# EAGLE design v5-Power-Section-temp (EAGLE 7.5.0)
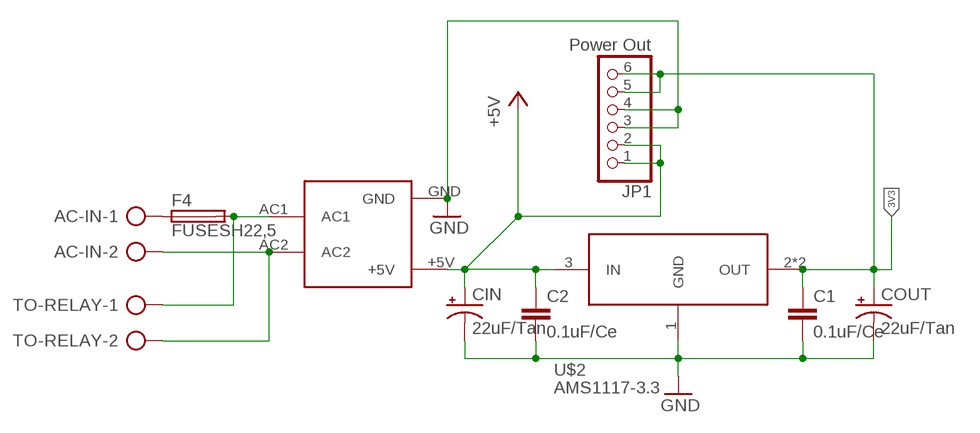
[diagram p0: schematic, sheet 1]

## Parts
AC-IN  AK300/2  [AK300/2]
C1  0.1uF/Ce  C-EU025-024X044  [C025-024X044]
C2  0.1uF/Ce  C-EU025-024X044  [C025-024X044]
CIN  22uF/Tan  CPOL-USE2.5-5  [E2,5-5]
COUT  22uF/Tan  CPOL-USE2.5-5  [E2,5-5]
F4  FUSESH22,5  [SH22,5]
JP1  Power Out  PINHD-1X6  [1X06]
TO-RELAY  AK300/2  [AK300/2]
U$1  HLK-PM01  [HLK-PM01]
U$2  AMS1117-3.3  [SOT-223]

## Nets
3V3: C1.1 COUT.+ JP1.5 JP1.6 U$2.2(OUT) U$2.4(OUT)
+5V: C2.1 CIN.+ JP1.1 JP1.2 U$1.+5V U$2.3(IN)
GND: C1.2 C2.2 CIN.- COUT.- JP1.3 JP1.4 U$1.GND U$2.1(GND)
N$1: AC-IN.1 F4.1
N$2: AC-IN.2 TO-RELAY.2 U$1.AC2
RELAY-NO: F4.2 TO-RELAY.1 U$1.AC1

## Library data of the parts
AC-IN TO-RELAY = con-ptr500:AK300/2: CONNECTOR; OC_FARNELL: unknown; OC_NEWARK: unknown
C1 C2 = rcl:C-EU: CAPACITOR, European symbol
CIN COUT = rcl:CPOL-US: POLARIZED CAPACITOR, American symbol
F4 = fuse:FUSE: Fuse; OC_FARNELL: unknown; OC_NEWARK: unknown
JP1 = pinhead:PINHD-1X6: PIN HEADER
U$1 = HLK-PM01:HLK-PM01
U$2 = AMS1117-3.3:AMS1117-3.3: 1A LOW DROPOUT VOLTAGE REGULATOR

## Board
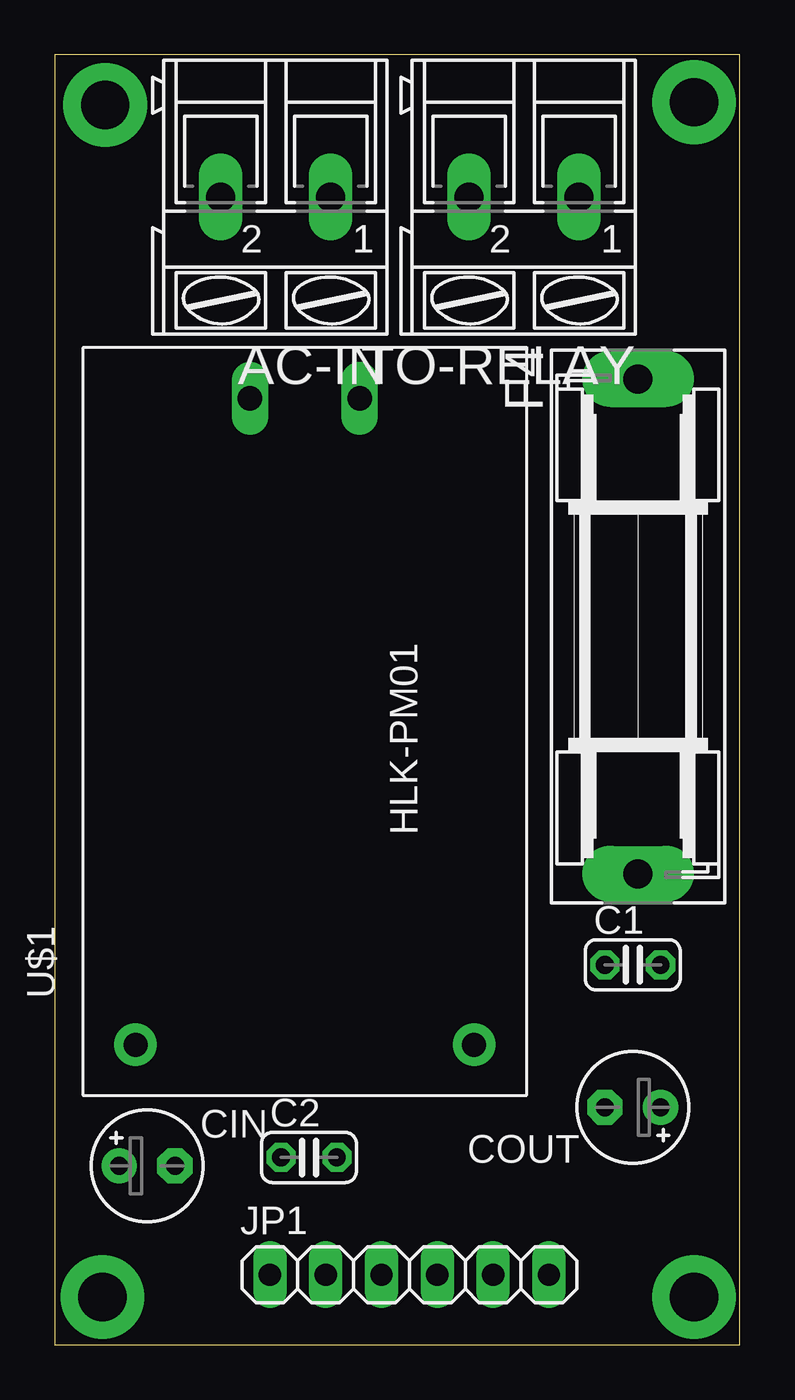
[diagram p1: board, top side]
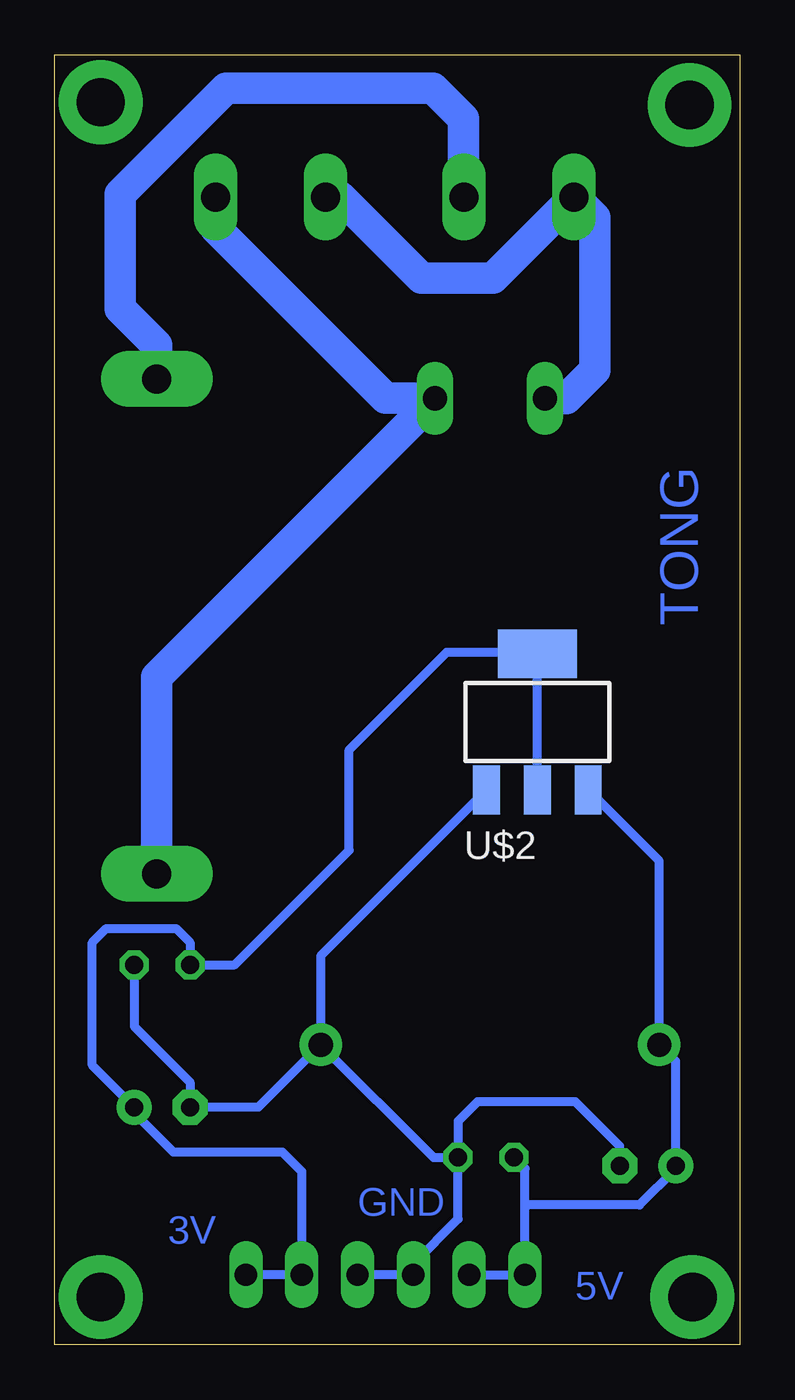
[diagram p2: board, bottom side, seen from below]

Size 31.17 x 58.66 mm. Coordinates in mm from the lower left corner, seen from the top.
Outline: 0,0 31.17,0 31.17,58.66 0,58.66 0,0
Copper layers (1*16): Top 0.035mm / dielectric 1.5mm / Bottom 0.035mm
Design rules "default": minimum track width 10mil, minimum drill 24mil, track to track 8mil, track to pad 8mil, pad to pad 8mil, via to via 8mil, smd to smd 8mil, copper to edge 40mil, drill to drill 8mil, minimum pad ring 10mil, minimum via ring 8mil, stop-mask expansion 4mil, vias tented up to drill 0mil, thermal gap 10mil

### Footprints (pad centres in the part's own frame; a part is rotated, then mirrored left to right if it is on the bottom)
AK300/2 = drill 1.321 long: 1 -2.515,0; 2 2.489,0
C025-024X044 = drill 0.813 octagon: 1 -1.27,0; 2 1.27,0
E2,5-5 = drill 0.813 pad 1.6: + -1.27,0 | drill 0.813 pad 1.6 octagon: - 1.27,0
SH22,5 = drill 1.321 pad 2.54 long: 1 -11.252,0; 2 11.252,0
1X06 = drill 1.016 long: 1 -6.35,0; 2 -3.81,0; 3 -1.27,0; 4 1.27,0; 5 3.81,0; 6 6.35,0
HLK-PM01 = drill 1.1 pad 1.93: +5V 15.19,-7.76; GND 15.19,7.64 | drill 1.1 long: AC1 -14.21,2.44; AC2 -14.21,-2.56
SOT-223 = smd 1.219 x 2.235: 1 -2.381,-3.099; 2 -0.07,-3.099; 3 2.241,-3.099 | smd 3.6 x 2.2: 4 -0.07,3.099

### Placement (x,y rotation side)
AC-IN  10.03,52.2 180 top
C1  26.29,17.27 0 top
C2  11.56,8.51 0 top
CIN  4.19,8.13 0 top
COUT  26.29,10.79 180 top
F4  26.53,32.67 270 top
JP1  16.13,3.17 0 top
TO-RELAY  21.34,52.2 180 top
U$1  11.43,28.83 270 top
U$2  9.14,28.32 0 bottom

### Tracks (layer width: path | path; a pad name or v marks a point on that pad's centre or on a via)
3V3
  Bottom 0.406: JP1.6 JP1.5 19.94,7.87 20.83,8.76 25.78,8.76 27.56,10.54 COUT.+ 29.46,12.7 29.46,18.29 28.83,18.92 25.65,18.92 25.02,18.29 C1.1 22.99,17.27 17.78,22.48 17.78,27.05 13.34,31.5 9.29,31.5 U$2.4 U$2.2
+5V
  Bottom 0.406: JP1.2 JP1.1 9.78,6.22 | 9.78,6.22 9.78,8 C2.1 | 9.78,6.22 9.65,6.35 4.57,6.35 2.92,8 CIN.+ 2.92,12.89 U$1.+5V 3.67,21.99 U$2.3
GND
  Bottom 0.406: C1.2 27.56,14.48 25.02,11.94 COUT.- 21.91,10.79 U$1.GND | U$1.GND 13.94,8.51 C2.2 | JP1.4 JP1.3 14.86,3.68 12.83,5.71 C2.2 | CIN.- 5.46,9.02 7.49,11.05 11.94,11.05 12.83,10.16 C2.2 | U$2.1 19.07,17.68 U$1.GND
N$1
  Bottom 1.422: AC-IN.1 12.57,52.22 12.57,55.75 13.97,57.15 23.37,57.15 28.19,52.32 28.19,47.12 26.53,45.46 F4.1
N$2
  Bottom 1.422: U$1.AC2 7.89,43.04 6.6,44.32 6.6,51.26 AC-IN.2 11.23,48.51 14.48,48.51 18.16,52.2 TO-RELAY.2
N$3  (via drill 2.2 pad 3.81)
  other vias: 2.29,56.39
N$4  (via drill 2.2 pad 3.81)
  other vias: 29.08,56.52
N$5  (via drill 2.2 pad 3.81)
  other vias: 29.08,2.16
N$6  (via drill 2.2 pad 3.81)
  other vias: 2.16,2.16
RELAY-NO
  Bottom 1.422: TO-RELAY.1 23.85,50.77 16.13,43.05 13.88,43.05 U$1.AC1 26.53,30.38 F4.2

### Text on the board
Bottom: TONG | GND | 3V | 5V